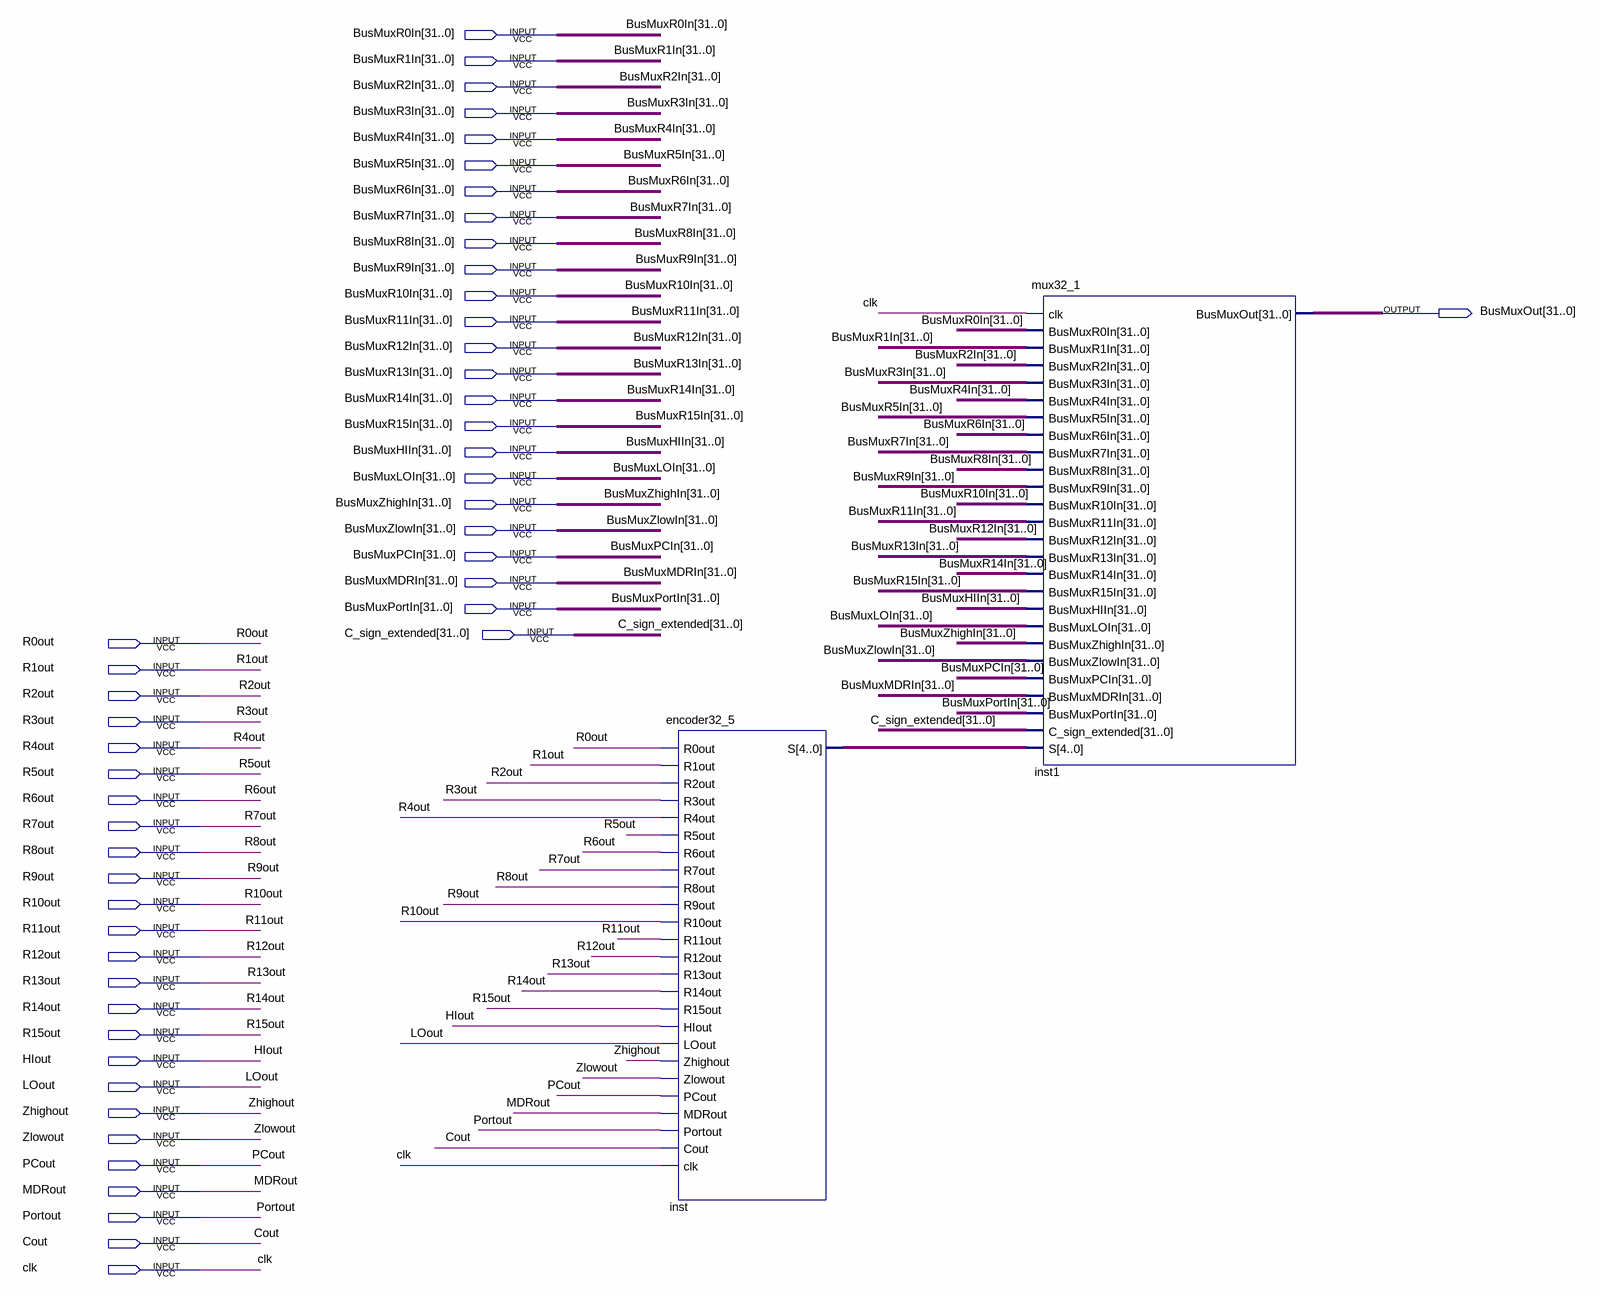
[diagram p0: schematic sheet]
// Quartus schematic Bus.bdf as structural Verilog: 2 symbols, 50 pins
module Bus (
  input  [31:0] BusMuxR0In,
  input  [31:0] BusMuxR1In,
  input  [31:0] BusMuxR2In,
  input  [31:0] BusMuxR3In,
  input  [31:0] BusMuxR4In,
  input  [31:0] BusMuxR5In,
  input  [31:0] BusMuxR6In,
  input  [31:0] BusMuxR7In,
  input  [31:0] BusMuxR8In,
  input  [31:0] BusMuxR9In,
  input  [31:0] BusMuxR10In,
  input  [31:0] BusMuxR11In,
  input  [31:0] BusMuxR12In,
  input  [31:0] BusMuxR13In,
  input  [31:0] BusMuxR14In,
  input  [31:0] BusMuxR15In,
  input  [31:0] BusMuxHIIn,
  input  [31:0] BusMuxLOIn,
  input  [31:0] BusMuxZhighIn,
  input  [31:0] BusMuxZlowIn,
  input  [31:0] BusMuxPCIn,
  input  [31:0] BusMuxMDRIn,
  input  [31:0] BusMuxPortIn,
  input  [31:0] C_sign_extended,
  input  R0out,
  input  R1out,
  input  R2out,
  input  R3out,
  input  R4out,
  input  R5out,
  input  R6out,
  input  R7out,
  input  R8out,
  input  R9out,
  input  R10out,
  input  R11out,
  input  R12out,
  input  R13out,
  input  R14out,
  input  R15out,
  input  HIout,
  input  LOout,
  input  Zhighout,
  input  Zlowout,
  input  PCout,
  input  MDRout,
  input  Portout,
  input  Cout,
  input  clk,
  output [31:0] BusMuxOut
);

  wire [4:0] inst_s;

  encoder32_5 inst (
    .R0out(R0out), .R1out(R1out), .R2out(R2out), .R3out(R3out), .R4out(R4out), .R5out(R5out), .R6out(R6out),
    .R7out(R7out), .R8out(R8out), .R9out(R9out), .R10out(R10out), .R11out(R11out), .R12out(R12out),
    .R13out(R13out), .R14out(R14out), .R15out(R15out), .HIout(HIout), .LOout(LOout), .Zhighout(Zhighout),
    .Zlowout(Zlowout), .PCout(PCout), .MDRout(MDRout), .Portout(Portout), .Cout(Cout), .clk(clk), .S(inst_s));
  mux32_1 inst1 (
    .clk(clk), .BusMuxR0In(BusMuxR0In), .BusMuxR1In(BusMuxR1In), .BusMuxR2In(BusMuxR2In),
    .BusMuxR3In(BusMuxR3In), .BusMuxR4In(BusMuxR4In), .BusMuxR5In(BusMuxR5In), .BusMuxR6In(BusMuxR6In),
    .BusMuxR7In(BusMuxR7In), .BusMuxR8In(BusMuxR8In), .BusMuxR9In(BusMuxR9In), .BusMuxR10In(BusMuxR10In),
    .BusMuxR11In(BusMuxR11In), .BusMuxR12In(BusMuxR12In), .BusMuxR13In(BusMuxR13In),
    .BusMuxR14In(BusMuxR14In), .BusMuxR15In(BusMuxR15In), .BusMuxHIIn(BusMuxHIIn), .BusMuxLOIn(BusMuxLOIn),
    .BusMuxZhighIn(BusMuxZhighIn), .BusMuxZlowIn(BusMuxZlowIn), .BusMuxPCIn(BusMuxPCIn),
    .BusMuxMDRIn(BusMuxMDRIn), .BusMuxPortIn(BusMuxPortIn), .C_sign_extended(C_sign_extended), .S(inst_s),
    .BusMuxOut(BusMuxOut));
endmodule
